# Altium schematic sheet 8T49N241-999NLGI.SchDoc: Bardzo zaawansowany, madrze brzmiacy temat pracy dyplomowej. Jest tez bardzo dlugi.
size A4 portrait; Author: Student X.; Revision: 1.1; SheetNumber: 3; SheetTotal: 3; Comments: param:Comments; Wersja: 1.1; CustomerInfo: CustInfo; CustomerAddress: CustAddr; CopyrightBy: Maciejo; CopyrightDate: 2016; TopSheet: Nazwa lub sciezka do pliku z glownym schematem projektu; CurrentSheet: Current sheet; NrIndeksu: 123456; Promotor: Prof. dr. hab. inż. arch. lek. artysta i tynkarz; ProjectName: Project Name
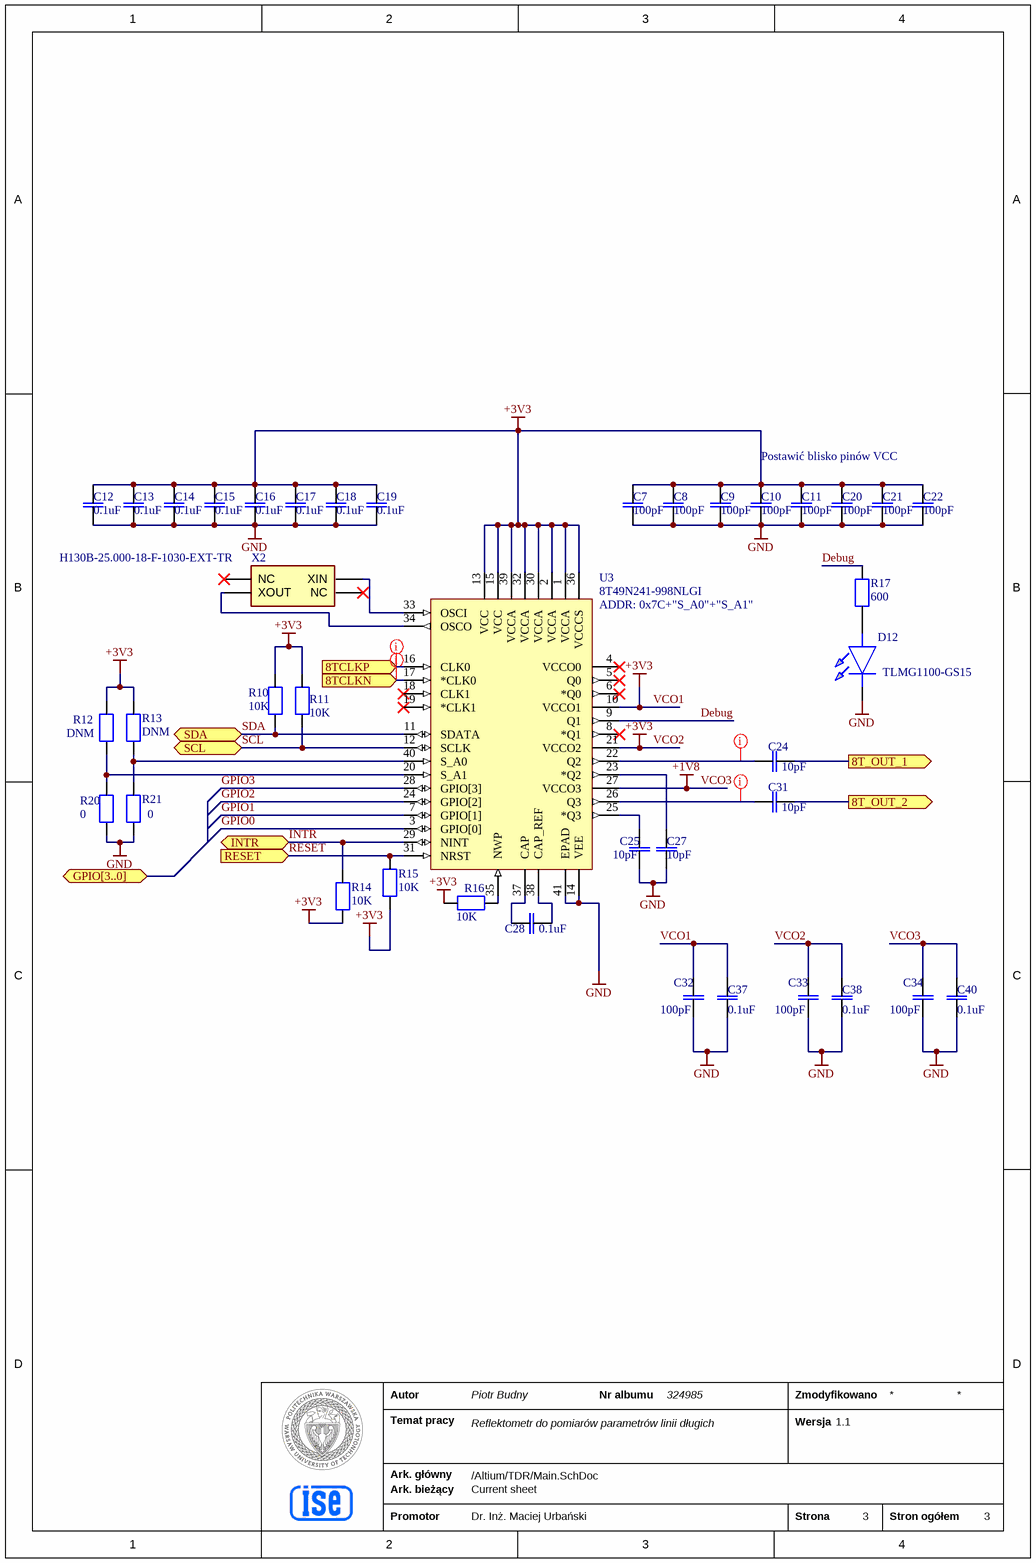
[diagram p0: 8T49N241-999NLGI.SchDoc]

## Parts
C7  100pF  [CAPC0603]
C8  100pF  [CAPC0603]
C9  100pF  [CAPC0603]
C10  100pF  [CAPC0603]
C11  100pF  [CAPC0603]
C12  0.1uF  [CAPC0603]
C13  0.1uF  [CAPC0603]
C14  0.1uF  [CAPC0603]
C15  0.1uF  [CAPC0603]
C16  0.1uF  [CAPC0603]
C17  0.1uF  [CAPC0603]
C18  0.1uF  [CAPC0603]
C19  0.1uF  [CAPC0603]
C20  100pF  [CAPC0603]
C21  100pF  [CAPC0603]
C22  100pF  [CAPC0603]
C24  10pF  [CAPC0402]
C25  10pF  [CAPC0402]
C27  10pF  [CAPC0402]
C28  0.1uF  [CAPC0603]
C31  10pF  [CAPC0402]
C32  100pF  [CAPC0603]
C33  100pF  [CAPC0603]
C34  100pF  [CAPC0603]
C37  0.1uF  [CAPC0603]
C38  0.1uF  [CAPC0603]
C40  0.1uF  [CAPC0603]
D12  TLMG1100-GS15  [TLMG1100GS15]
R10  10K  [RES0805]
R11  10K  [RES0805]
R12  DNM  [RES0805]
R13  DNM  [RES0805]
R14  10K  [RES0805]
R15  10K  [RES0805]
R16  10K  [RES0805]
R17  600  [RES0805]
R20  0  [RES0805]
R21  0  [RES0805]
U3  8T49N241-998NLGI  [NLG40P2_MFG]
X2  H130B-25.000-18-F-1030-EXT-TR  [H130B2500018F1030EXTTR]

## Ports
8T_OUT_1 (out, see Main[4B], TDR_Schematic_PB[3B]), 8T_OUT_2 (out, see Main[4B], TDR_Schematic_PB[3B]), 8TCLKN (in, see Main[3B], TDR_Schematic_PB[3C]), 8TCLKP (in, see Main[3B], TDR_Schematic_PB[3C]), GPIO[3..0] (bidir, see Main[3A], TDR_Schematic_PB[3A]), INTR (bidir, see Main[3A], TDR_Schematic_PB[2B]), RESET (in, see Main[3A], TDR_Schematic_PB[2B]), SCL (bidir, see Main[3A], TDR_Schematic_PB[2A]), SDA (bidir, see Main[3A], TDR_Schematic_PB[2B])

## Nets
GND: C7.2 C8.2 C9.2 C10.2 C11.2 C12.1 C13.1 C14.1 C15.1 C16.1 C17.1 C18.1 C19.1 C20.2 C21.2 C22.2 C25.1 C27.1 C32.2 C33.2 C34.2 C37.1 C38.1 C40.1 D12.1(K) R20.1 R21.1 U3.14(VEE) U3.41(EPAD)
VCO1: C7.1 C8.1 C9.1 C10.1 C11.1 C12.2 C13.2 C14.2 C15.2 C16.2 C17.2 C18.2 C19.2 C20.1 C21.1 C22.1 C32.1 C33.1 C37.2 C38.2 R10.2 R11.2 R12.2 R13.2 R14.1 R15.1 R16.2 U3.1(VCCA) U3.2(VCCA) U3.10(VCCO1) U3.13(VCC) U3.15(VCC) U3.21(VCCO2) U3.30(VCCA) U3.32(VCCA) U3.36(VCCCS) U3.39(VCCA)  [also labelled +3V3, VCO2]
VCO3: C34.1 C40.2 U3.27(VCCO3)  [also labelled +1V8]
8T_OUT_1: C24.2 ; port 8T_OUT_1
8T_OUT_2: C31.2 ; port 8T_OUT_2
8TCLKN: U3.17(*CLK0) ; port 8TCLKN
8TCLKP: U3.16(CLK0) ; port 8TCLKP
Debug: R17.1 U3.9(Q1)
GPIO0: U3.3(GPIO[0])
GPIO1: U3.7(GPIO[1])
GPIO2: U3.24(GPIO[2])
GPIO3: U3.28(GPIO[3])
INTR: R14.2 U3.29(NINT) ; port INTR
RESET: R15.2 U3.31(NRST) ; port RESET
SCL: R11.1 U3.12(SCLK) ; port SCL
SDA: R10.1 U3.11(SDATA) ; port SDA
NetC24_1: C24.1 U3.22(Q2)
NetC25_2: C25.2 U3.25(*Q3)
NetC27_2: C27.2 U3.23(*Q2)
NetC28_1: C28.1 U3.38(CAP_REF)
NetC28_2: C28.2 U3.37(CAP)
NetC31_1: C31.1 U3.26(Q3)
NetD12_2: D12.2(A) R17.2
NetR12_1: R12.1 R20.2 U3.20(S_A1)
NetR13_1: R13.1 R21.2 U3.40(S_A0)
NetR16_1: R16.1 U3.35(NWP)
NetU3_33: U3.33(OSCI) X2.1(XIN)
NetU3_34: U3.34(OSCO) X2.3(XOUT)

Not connected (* = marked no-connect by the designer): U3 4(VCCO0)* 5(Q0)* 6(*Q0)* 8(*Q1)* 18(CLK1)* 19(*CLK1)*; X2 2(NC)* 4(NC)*

## Layout directives
net class Signal: NetC24_1, NetC31_1
net class Diff_Signal: 8TCLKN, 8TCLKP

## Notes on the sheet
- Postawić blisko pinów VCC
- (near U3) ADDR: 0x7C+"S_A0"+"S_A1"
- Autor
- Temat pracy
- Piotr Budny
- Reflektometr do pomiarów parametrów linii długich
- Nr albumu
- 324985
- Zmodyfikowano
- Wersja
- Ark. główny
- Ark. bieżący
- /Altium/TDR/Main.SchDoc
- Promotor
- Dr. Inż. Maciej Urbański
- Strona
- Stron ogółem

## Library data of the parts
C7-C11 C20-C22 C24 C25 C27 C31-C34 = C0603: No Description Available; Manufacturer_Name: Kemet; Manufacturer_Part_Number: C0805X399C8HAC7800; Copyright: Copyright (C) 2025 Ultra Librarian. All rights reserved.
C12-C19 C37 C38 C40 = C0603: CAP SMD 0805; Manufacturer_Name: Kemet; Manufacturer_Part_Number: C0805X399C8HAC7800; Copyright: Copyright (C) 2025 Ultra Librarian. All rights reserved.
C28 = C0603: CAP SMD 0603; Manufacturer_Name: Kemet; Manufacturer_Part_Number: C0805X399C8HAC7800; Copyright: Copyright (C) 2025 Ultra Librarian. All rights reserved.
D12 = TLMG1100-GS15: Standard LEDs - SMD CHIPLED(SMD 0603-LED) GREEN U.BRIGHT-E4; Manufacturer_Name: Vishay; Geometry.Height: 0.65mm; Mouser Part Number: 78-TLMG1100-GS15; Mouser Price/Stock: https://www.mouser.co.uk/ProductDetail/Vishay-Semiconductors/TLMG1100-GS15?qs=vvQtp7zwQdObPNLeC1kn7g%3D%3D; Manufacturer_Part_Number: TLMG1100-GS15; Datasheet Link: https://www.vishay.com/docs/83173/tlmx1100.pdf
R10-R17 R20 R21 = R0805: RES SMD 0805; MP: RT0805FRE075K36L; Package: None; Price: None; Value: *; Availability: Unavailable
U3 = 8T49N241-999NLGI: Tin Active e3 CLOCK GENERATOR OTHER (Type) IC 18Weeks -40C 6mm 1GHz; Number of Circuits: 1; Input: Crystal; Interface: I2C; Phase Jitter: 350fs; Max Input Voltage: 3.465V; Pitch: 500µm; Output Type: HCSL, LVCMOS, LVDS, LVPECL; Min Input Voltage: 1.71V; ComponentLink2URL: https://octopart.com/cad-content/api/get-model-datasheet/15189/106937583; RoHS: Compliant; Lead Free: Lead Free; Max Operating Temperature: 85°C; Lifecycle Status: Production; ComponentLink1URL: http://www.renesas.com; Max Frequency: 1GHz; Contact Plating: Tin; Export Control Classification Number (ECCN) Code: NLR; ComponentLink2Description: Datasheet URL; HelpURL: https://octopart.com/cad-content/api/get-model-datasheet/15189/106937583; Length: 6mm; MSL: 3; Part Family: 8T49N241; Height: 900µm; Max Output Frequency: 1GHz; ComponentLink1Description: Manufacturer's Website; ComponentLink3URL: https://www.renesas.com/en/document/psc/package-outline-drawing-package-code-nlg40p2-40-vfqfp-n-60-x-60-x-090-mm-body-05mm-pitch; Width: 6mm; ComponentLink3Description: Manufacturer's Package Drawing; Number of Pins: 40; Manufacturer Lifecycle Status: ACTIVE; Min Operating Temperature: -40°C; Harmonized Tariff Schedule (HTS) Code: 8540000000; Thickness: 900µm; Mount: Surface Mount; Package Quantity: 0
X2 = H130B-25.000-18-F-1030-EXT-TR: MHz Crystal, 25 MHz, 5 x 3.2 mm, +/-10 ppm tolerance, +/-30 ppm stability, 18 pF, -40~85C, SMD; Manufacturer_Name: RALTRON; Geometry.Height: 0.9mm; Farnell Part Number: *; Farnell Price/Stock: *; Manufacturer_Part_Number: H130B-25.000-18-F-1030-EXT-TR; Datasheet Link: https://raltron.com/webproducts/specs/CRYSTAL/H130B-25.000-18-F-1030-EXT-TR.pdf